# Altium project Pulser.PrjPcb
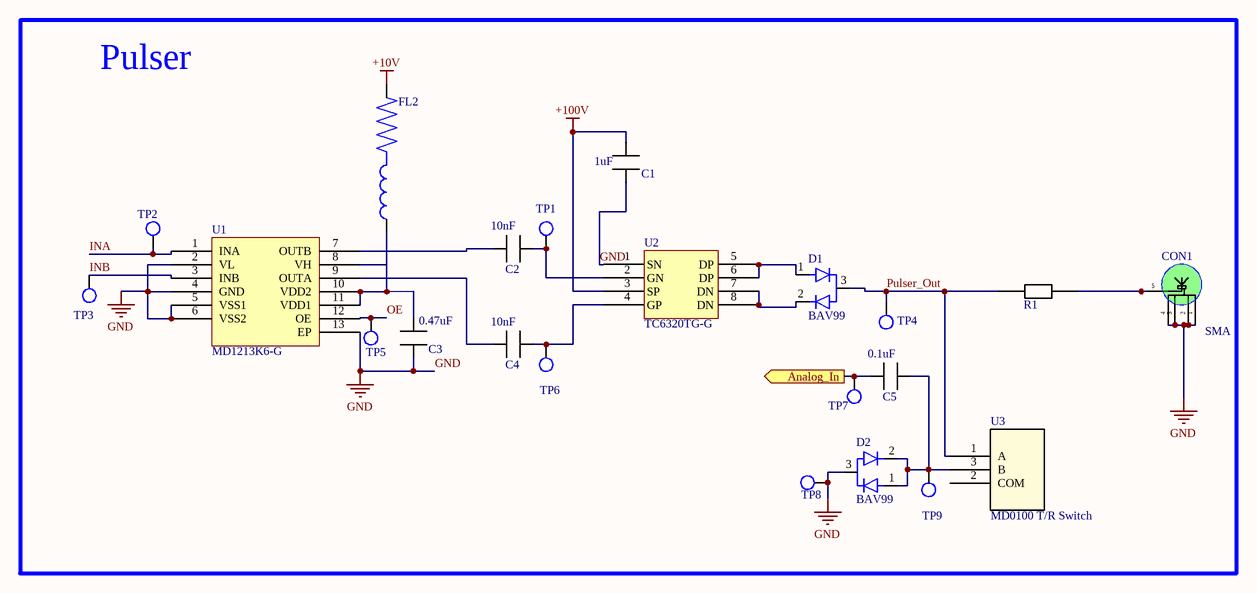
[diagram p0: Pulser.SchDoc]
5 sheets, 85 parts. Net scope: global (net labels, ports and power ports of the same name join across sheets).
Board file: Pulser.PcbDoc
Sheets:
  Pulser.SchDoc
  Analog Front End.SchDoc
  ADC.SchDoc
  Power.SchDoc
  Boost Converter.SchDoc

## Sheet Pulser.SchDoc
size A4; SheetNumber: 1; SheetTotal: 5

### Parts
C1  1uF  [CAP_1206]
C2  10nF  [CAP_0805]
C3  0.47uF  [CAP_0805]
C4  10nF  [CAP_0805]
C5  0.1uF  [CAP_0805]
CON1  SMA  [A-SMA-KWE-15.1A]
D1  BAV99  [DIO_BAV99]
D2  BAV99  [DIO_BAV99]
FL2  (no value)  [BEAD1206S601A40T]
R1  200R  [RES_0805]  (value not drawn)
TP1  TP  [CON_TP]  (value not drawn)
TP2  TP  [CON_TP]  (value not drawn)
TP3  TP  [CON_TP]  (value not drawn)
TP4  TP  [CON_TP]  (value not drawn)
TP5  TP  [CON_TP]  (value not drawn)
TP6  TP  [CON_TP]  (value not drawn)
TP7  TP  [CON_TP]  (value not drawn)
TP8  TP  [CON_TP]  (value not drawn)
TP9  TP  [CON_TP]  (value not drawn)
U1  MD1213K6-G  [QFN80P400X400X90-13N]
U2  TC6320TG-G  [SOIC127P600X175-8N]
U3  MD0100 T/R Switch  [TO-243AA_MCH]

### Blocks framed on the sheet
Pulser: C1-C5 CON1 D1 D2 FL2 R1 TP1-TP9 U1-U3

### Ports
Analog_In (out)

### Nets
+10V: FL2.2
+100V: C1.2 U2.3(SP)
GND: C1.1 C3.2 CON1.1 CON1.2 CON1.3 CON1.4 D2.3 TP8.1(A1) U1.2(VL) U1.4(GND) U1.5(VSS1) U1.6(VSS2) U1.13(EP) U2.1(SN)
Analog_In: C5.1 TP7.1(A1) ; port Analog_In
INA: TP2.1(A1) U1.1(INA)
INB: TP3.1(A1) U1.3(INB)
OE: TP5.1(A1) U1.12(OE)
Pulser_Out: D1.3 R1.1 TP4.1(A1) U3.1(A)
NetC2_1: C2.1 U1.7(OUTB)
NetC2_2: C2.2 TP1.1(A1) U2.2(GN)
NetC3_1: C3.1 FL2.1 U1.8(VH) U1.10(VDD2) U1.11(VDD1)
NetC4_1: C4.1 U1.9(OUTA)
NetC4_2: C4.2 TP6.1(A1) U2.4(GP)
NetC5_2: C5.2 D2.1 D2.2 TP9.1(A1) U3.3(B)
NetCON1_5: CON1.5 R1.2
NetD1_1: D1.1 U2.5(DP) U2.6(DP)
NetD1_2: D1.2 U2.7(DN) U2.8(DN)

Not connected (* = marked no-connect by the designer): U3 2(COM)

### Library data of the parts
C1 = CAP_1206: note: any manufacturer; val: 1uF
C2-C5 = CAP_0805: note: any manufacturer
  C2 C4: val: 10nF
  C3: val: 0.47uF
  C5: val: 0.1uF
CON1 = A-SMA-KWE-15.1A: SMA Connector - 1 Inner Bore SMA Board Side Elbow 6GHz 50Ω 5.35mm Through Hole Coaxial Connector (RF) Adapters RoHS; val: MyAntenna A-SMA-KWE-15.1A; sample link: https://www.lcsc.com/product-detail/C49253491.html?s_z=n_SMA
D1 D2 = BAV99: Diode Array 1 Pair Series Connection Standard 100V 215mA (DC) Surface Mount TO-236-3, SC-59, SOT-23-3; MF: ON Semiconductor; Price: None; Availability: In Stock; MP: BAV99; Package: SOT-23-3 Motorola; SnapEDA_Link: https://www.snapeda.com/parts/BAV99/Onsemi/view-part/?ref=snap; Check_prices: https://www.snapeda.com/parts/BAV99/Onsemi/view-part/?ref=eda; Value: *; Purchase-URL: https://pricing.snapeda.com/search/part/BAV99/?ref=eda
FL2 = BEAD1206S601A40T: MF: Murata; MP: BLM03EB500SZ1D; SnapEDA_Link: https://www.snapeda.com/parts/BLM03EB500SZ1D/Murata/view-part/?ref=snap; Package: 0603 Murata; Value: *; Check_prices: https://www.snapeda.com/parts/BLM03EB500SZ1D/Murata/view-part/?ref=eda
R1 = RES_0805: note: any manufacturer; val: 200R
TP1-TP9 = Test_Point
U3 = MD0100N8-G: Description; Manufacturer_Name: Microchip; Copyright: Copyright (C) 2025 Ultra Librarian. All rights reserved.; Manufacturer_Part_Number: MD0100N8-G; RefDes: RefDes; Type: Type

## Sheet Analog Front End.SchDoc
size A; SheetNumber: 2; SheetTotal: 5
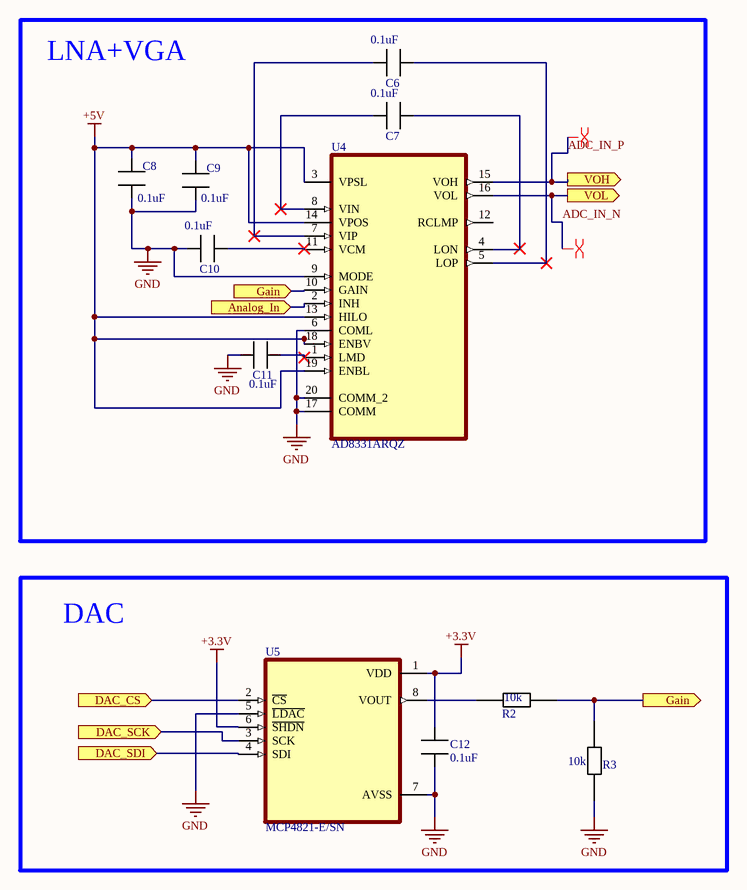
[diagram p1: Analog Front End.SchDoc]

### Parts
C6  0.1uF  [CAP_0805]
C7  0.1uF  [CAP_0805]
C8  0.1uF  [CAP_0805]
C9  0.1uF  [CAP_0805]
C10  0.1uF  [CAP_0805]
C11  0.1uF  [CAP_0805]
C12  0.1uF  [CAP_0805]
R2  10k  [RES_0805]
R3  10k  [RES_0805]
U4  AD8331ARQZ  [SOP64P600X165-20N]
U5  MCP4821-E/SN  [SOIC127P600X175-8N]

### Blocks framed on the sheet
LNA+VGA: C6-C11 U4
DAC: C12 R2 R3 U5

### Ports
Analog_In (in), DAC_CS (in), DAC_SCK (in), DAC_SDI (in), Gain (in), Gain (out), VOH (out), VOL (out)

### Nets
+3.3V: C12.2 U5.1(VDD) U5.6(~{SHDN})
+5V: C8.2 C9.2 U4.3(VPSL) U4.13(HILO) U4.14(VPOS) U4.18(ENBV) U4.19(ENBL)
GND: C8.1 C9.1 C10.1 C11.1 C12.1 R3.1 U4.6(COML) U4.9(MODE) U4.17(COMM) U4.20(COMM_2) U5.5(~{LDAC}) U5.7(AVSS)
ADC_IN_N: U4.16(VOL) ; port VOL
ADC_IN_P: U4.15(VOH) ; port VOH
Analog_In: U4.2(INH) ; port Analog_In
DAC_CS: U5.2(~{CS}) ; port DAC_CS
DAC_SCK: U5.3(SCK) ; port DAC_SCK
DAC_SDI: U5.4(SDI) ; port DAC_SDI
Gain: R2.2 R3.2 U4.10(GAIN) ; port Gain
NetC6_1: C6.1 U4.7(VIP)
NetC6_2: C6.2 U4.5(LOP)
NetC7_1: C7.1 U4.8(VIN)
NetC7_2: C7.2 U4.4(LON)
NetC10_2: C10.2 U4.11(VCM)
NetC11_2: C11.2 U4.1(LMD)
NetR2_1: R2.1 U5.8(VOUT)

Not connected (* = marked no-connect by the designer): U4 12(RCLMP)

### Layout directives
differential pair: ADC_IN_N, ADC_IN_P

### Library data of the parts
C6-C12 = CAP_0805: note: any manufacturer; val: 0.1uF
R2 R3 = RES_0805: note: any manufacturer; val: 10k
U4 = AD8331ARQZ: Single VGA with Ultralow Noise Preamplifier and Programmable RIN; MF: Analog Devices; SnapEDA_Link: https://www.snapeda.com/parts/AD8331ARQZ/Analog+Devices/view-part/?ref=snap; Package: QSOP-20 Analog Devices; Value: *; MP: AD8331ARQZ; Check_prices: https://www.snapeda.com/parts/AD8331ARQZ/Analog+Devices/view-part/?ref=eda
U5 = MCP4821-E/SN: SINGLE 12-BIT DAC WITH SPI INTERACE AND INTERNAL VREF, SOIC-8 | Microchip Technology Inc. MCP4821-E/SN; SnapEDA_Link: https://www.snapeda.com/parts/MCP4821-E/SN/Microchip+Technology/view-part/?ref=snap; Package: SOIC-8 Microchip; Value: *; MF: Microchip; MP: MCP4821-E/SN; Check_prices: https://www.snapeda.com/parts/MCP4821-E/SN/Microchip+Technology/view-part/?ref=eda

## Sheet ADC.SchDoc
size A; SheetNumber: 3; SheetTotal: 5
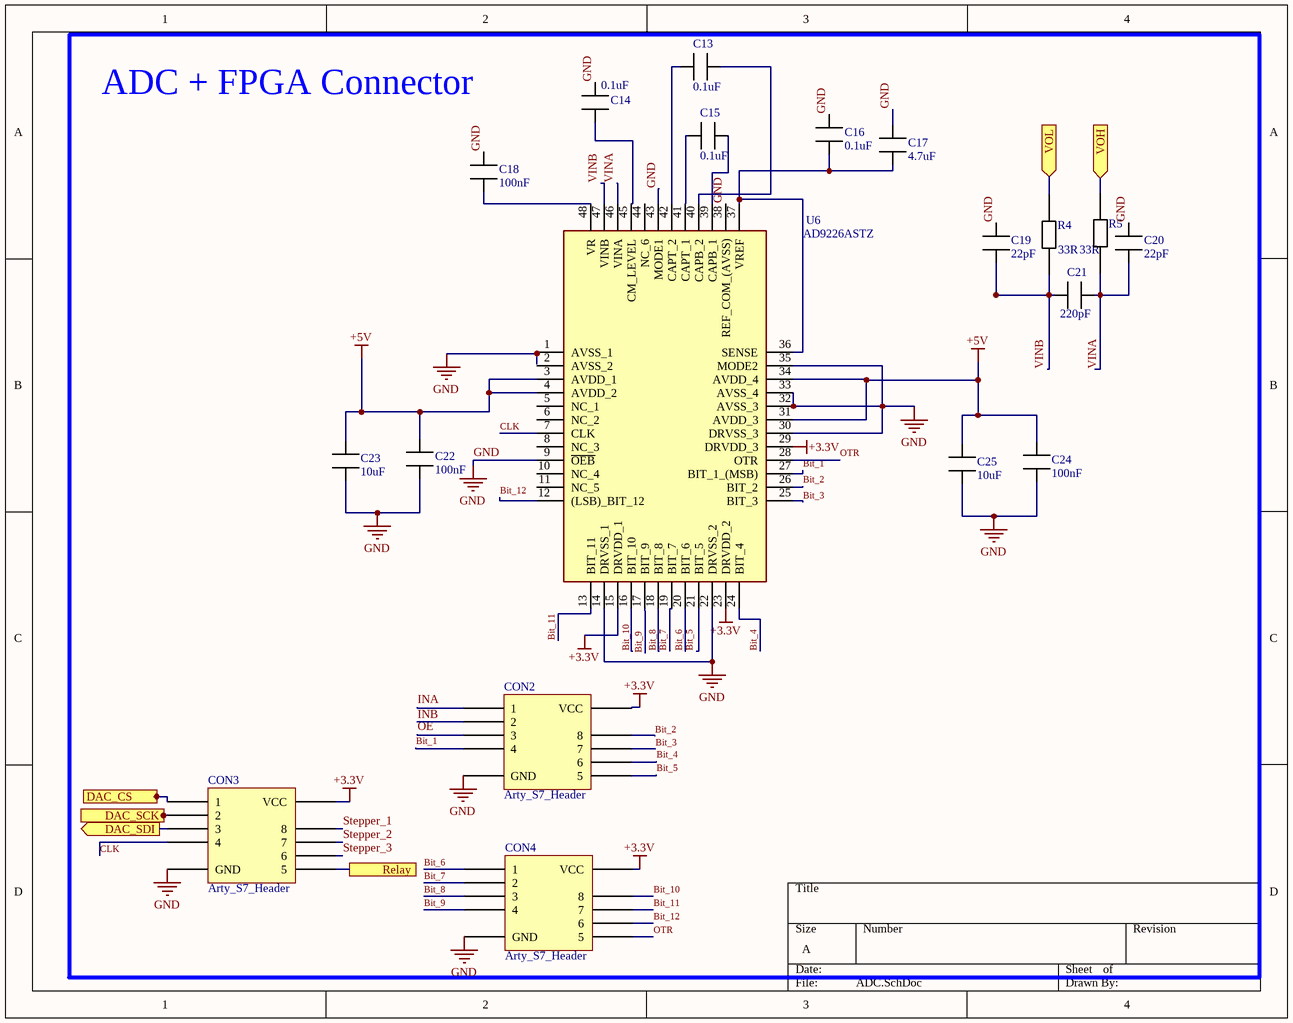
[diagram p2: ADC.SchDoc]

### Parts
C13  0.1uF  [CAP_0805]
C14  0.1uF  [CAP_0805]
C15  0.1uF  [CAP_0805]
C16  0.1uF  [CAP_0805]
C17  4.7uF  [CAP_0805]
C18  100nF  [CAP_0805]
C19  22pF  [CAP_0805]
C20  22pF  [CAP_0805]
C21  220pF  [CAP_0805]
C22  100nF  [CAP_0805]
C23  10uF  [CAP_0805]
C24  100nF  [CAP_0805]
C25  10uF  [CAP_0805]
CON2  Arty_S7_Header  [CON_2x6_2.54MM_THT]
CON3  Arty_S7_Header  [CON_2x6_2.54MM_THT]
CON4  Arty_S7_Header  [CON_2x6_2.54MM_THT]
R4  33R  [RES_0805]
R5  33R  [RES_0805]
U6  AD9226ASTZ  [QFP50P900X900X160-48N]

### Ports
DAC_CS (out), DAC_SCK (out), DAC_SDI (out), Relay, VOH (in), VOL (in)

### Nets
+3.3V: CON2.6(VCC) CON3.6(VCC) CON4.6(VCC) U6.15(DRVDD_1) U6.23(DRVDD_2) U6.29(DRVDD_3)
+5V: C22.1 C23.2 C24.1 C25.2 U6.3(AVDD_1) U6.4(AVDD_2) U6.31(AVDD_3) U6.34(AVDD_4)
GND: C14.1 C16.1 C17.1 C18.1 C19.1 C20.1 C22.2 C23.1 C24.2 C25.1 CON2.5(GND) CON3.5(GND) CON4.5(GND) U6.1(AVSS_1) U6.9(~{OEB}) U6.14(DRVSS_1) U6.22(DRVSS_2) U6.30(DRVSS_3) U6.32(AVSS_3) U6.33(AVSS_4) U6.35(MODE2) U6.38(REF_COM_(AVSS)) U6.43(MODE1)
ADC_IN_N: R4.2 ; port VOL
ADC_IN_P: R5.2 ; port VOH
Bit_1: CON2.4 U6.27(BIT_1_(MSB))
Bit_2: CON2.10(8) U6.26(BIT_2)
Bit_3: CON2.9(7) U6.25(BIT_3)
Bit_4: CON2.8(6) U6.24(BIT_4)
Bit_5: CON2.7(5) U6.21(BIT_5)
Bit_6: CON4.1 U6.20(BIT_6)
Bit_7: CON4.2 U6.19(BIT_7)
Bit_8: CON4.3 U6.18(BIT_8)
Bit_9: CON4.4 U6.17(BIT_9)
Bit_10: CON4.10(8) U6.16(BIT_10)
Bit_11: CON4.9(7) U6.13(BIT_11)
Bit_12: CON4.8(6) U6.12((LSB)_BIT_12)
CLK: CON3.4 U6.7(CLK)
DAC_CS: CON3.1 ; port DAC_CS
DAC_SCK: CON3.2 ; port DAC_SCK
DAC_SDI: CON3.3 ; port DAC_SDI
INA: CON2.1
INB: CON2.2
OE: CON2.3
OTR: CON4.7(5) U6.28(OTR)
Relay: CON3.7(5) ; port Relay
Stepper_1: CON3.10(8)
Stepper_2: CON3.9(7)
Stepper_3: CON3.8(6)
VINA: C20.2 C21.2 R5.1 U6.46(VINA)
VINB: C19.2 C21.1 R4.1 U6.47(VINB)
NetC13_1: C13.1 U6.42(CAPT_2)
NetC13_2: C13.2 U6.40(CAPB_2)
NetC14_2: C14.2 U6.45(CM_LEVEL)
NetC15_1: C15.1 U6.41(CAPT_1)
NetC15_2: C15.2 U6.39(CAPB_1)
NetC16_2: C16.2 C17.2 U6.36(SENSE) U6.37(VREF)
NetC18_2: C18.2 U6.48(VR)

Not connected (* = marked no-connect by the designer): U6 2(AVSS_2) 5(NC_1) 6(NC_2) 8(NC_3) 10(NC_4) 11(NC_5) 44(NC_6)

### Notes on the sheet
- ADC + FPGA Connector

### Library data of the parts
C13-C25 = CAP_0805: note: any manufacturer
  C13-C16: val: 0.1uF
  C17: val: 4.7uF
  C18 C22 C24: val: 100nF
  C19 C20: val: 22pF
  C21: val: 220pF
  C23 C25: val: 10uF
CON2-CON4 = Arty_S7_Header: pin to pad: 5>5+11 6>6+12
R4 R5 = RES_0805: note: any manufacturer; val: 33R
U6 = AD9226ASTZ: AD9226ASTZ, 12 bit-Bit DAC 65Msps, Parallel, 48-Pin LQFP; Manufacturer_Name: Analog Devices; Geometry.Height: 1.6mm; Manufacturer_Part_Number: AD9226ASTZ; Mouser Part Number: 584-AD9226ASTZ; Mouser Price/Stock: https://www.mouser.co.uk/ProductDetail/Analog-Devices/AD9226ASTZ?qs=%2FtpEQrCGXCz2C6o%252BfI8LqA%3D%3D; Arrow Part Number: AD9226ASTZ; Arrow Price/Stock: https://www.arrow.com/en/products/ad9226astz/analog-devices?utm_currency=USD&region=nac; Datasheet Link: https://datasheet.datasheetarchive.com/originals/distributors/Datasheets-4/DSA-70171.pdf

## Sheet Power.SchDoc
size A; SheetNumber: 4; SheetTotal: 5
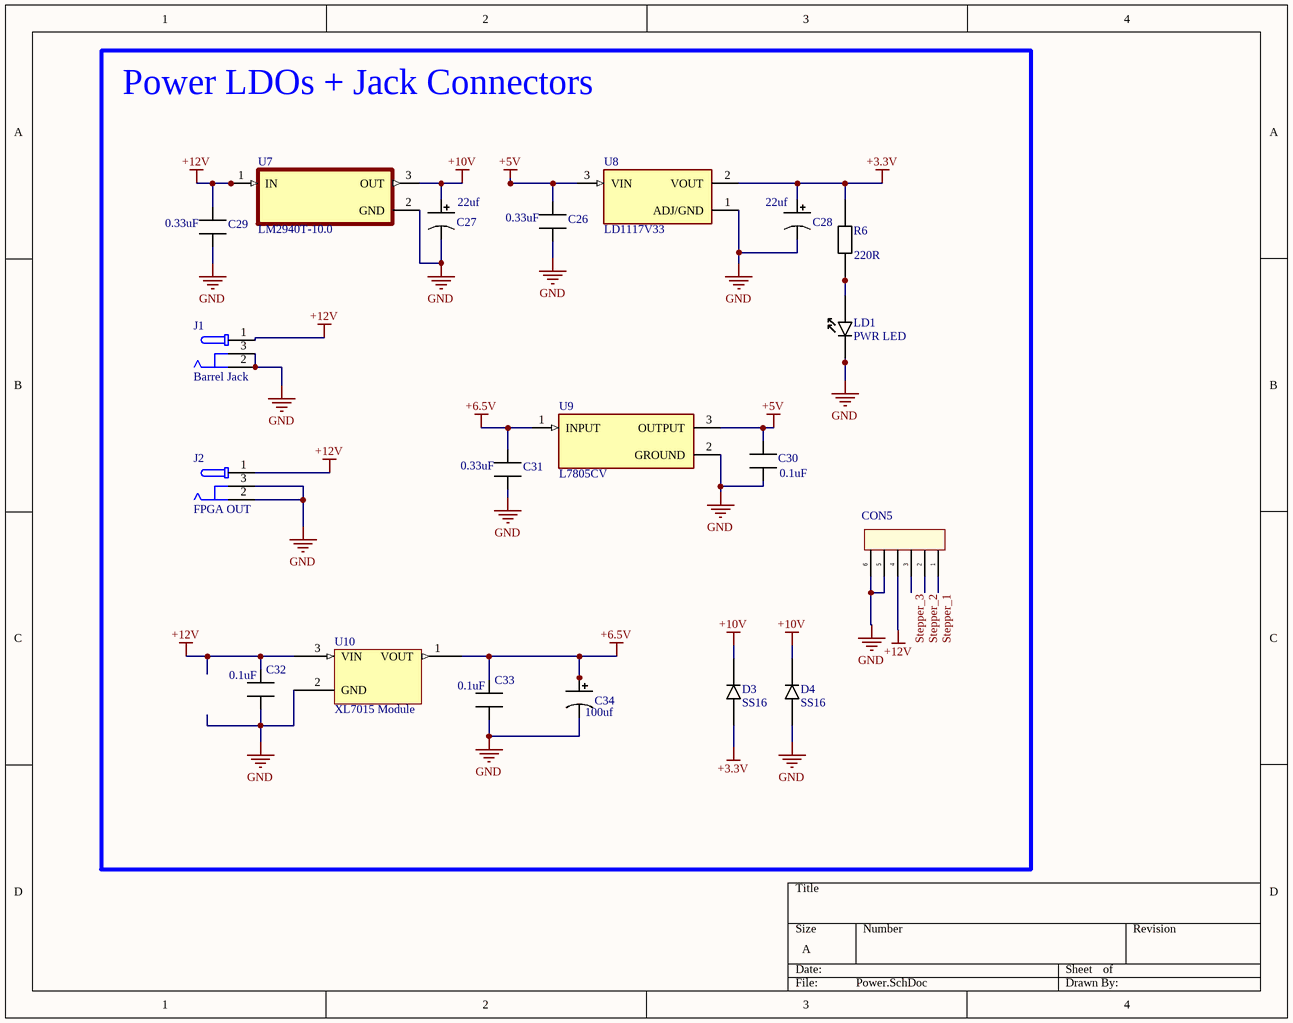
[diagram p3: Power.SchDoc]

### Parts
C26  0.33uF  [CAP_0805]
C27  22uf  [CAP_CAN_D5MM]
C28  22uf  [CAP_CAN_D5MM]
C29  0.33uF  [CAP_0805]
C30  0.1uF  [CAP_0805]
C31  0.33uF  [CAP_0805]
C32  0.1uF  [CAP_0805]
C33  0.1uF  [CAP_0805]
C34  100uf  [CAP_CAN_D5MM]
CON5  KF2EDGV-bend-3.81-6p  [CONGREEN_1x6_3.81]  (value not drawn)
D3  SS16  [DO-214AC]
D4  SS16  [DO-214AC]
J1  Barrel Jack  [MPD_EJ503A]
J2  FPGA OUT  [MPD_EJ503A]
LD1  PWR LED  [LED_0805]
R6  220R  [RES_0805]
U7  LM2940T-10.0  [TO254P1054X470X1955-3]
U8  LD1117V33  [TO255P1020X450X1968-3]
U9  L7805CV  [TO255P1040X460X1968-3]
U10  XL7015 Module  [XL7015]

### Blocks framed on the sheet
Power LDOs + Jack Connectors: C26-C34 CON5 D3 D4 J1 J2 LD1 R6 U7-U10

### Nets
+3.3V: C28.1 D3.2 R6.2 U8.2(VOUT)
+5V: C26.2 C30.2 U8.3(VIN) U9.3(OUTPUT)
+6.5V: C31.2 C33.2 C34.1 U9.1(INPUT) U10.1(VOUT)
+10V: C27.1 D3.1 D4.1 U7.3(OUT)
+12V: C29.2 C32.2 CON5.4 J1.1 J2.1 U7.1(IN) U10.3(VIN)
GND: C26.1 C27.2 C28.2 C29.1 C30.1 C31.1 C32.1 C33.1 C34.2 CON5.5 CON5.6 D4.2 J1.2 J1.3 J2.2 J2.3 LD1.1 U7.2(GND) U8.1(ADJ/GND) U9.2(GROUND) U10.2(GND)
Stepper_1: CON5.1
Stepper_2: CON5.2
Stepper_3: CON5.3
NetLD1_2: LD1.2 R6.1

### Library data of the parts
C26 C29-C33 = CAP_0805: note: any manufacturer
  C26 C29 C31: val: 0.33uF
  C30 C32 C33: val: 0.1uF
C27 C28 C34 = CAP_CAN_D5mm: SMD Can Capacitor; 5mm Diameter; note: any manufacturer; sample link: https://www.lcsc.com/product-detail/C3357.html?s_z=n_10uF%2520SMD%2520Can%2520Capacitor%2520D5%2520RVT
  C27 C28: val: 22uf
  C34: val: 100uf
CON5 = CONGREEN_1x6_3.81: note: any manufacturer; val: KF2EDGV-bend-3.81-6p; sample link: https://detail.tmall.com/item.htm?abbucket=7&id=563239224672&mi_id=0000eNg2RX4a54sA2dO6nQBcXewI5pOIaHq0cbOnq7H1ZG4&ns=1&priceTId=2100c82417719338414588309e0c91&skuId=3549204641034&spm=a21n57.1.hoverItem.2&utparam=%7B%22aplus_abtest%22%3A%22cd8050d06d499e492f7c0b37ee11abfb%22%7D&xxc=taobaoSearch
D3 D4 = SS16: Independent 60V 700mV@1A 1A SMA(DO-214AC) Single Diodes RoHS; note: any manufacturer; val: SS16; sample link: https://www.lcsc.com/product-detail/Schottky-Barrier-Diodes-SBD_GOODWORK-SS16_C2943739.html; unit price: $ 0.0122
J1 J2 = EJ503A: Power Barrel Connector Jack 2.10mm ID (0.083), 5.50mm OD (0.217) Through Hole, Right Angle; MF: MPD; Package: None; Price: None; Check_prices: https://www.snapeda.com/parts/EJ503A/MPD+%2528Memory+Protection+Devices%2529/view-part/?ref=eda; Value: *; SnapEDA_Link: https://www.snapeda.com/parts/EJ503A/MPD+%2528Memory+Protection+Devices%2529/view-part/?ref=snap; MP: EJ503A; Availability: In Stock; Purchase-URL: https://pricing.snapeda.com/search?q=EJ503A&ref=eda
LD1 = LED_0805
R6 = RES_0805: note: any manufacturer; val: 220R
U7 = LM2940T-10.0: 1-A, 26-V, high-PSRR, low-dropout voltage regulator 3-TO-220 -40 to 125; MF: Texas Instruments; MP: LM2940T-5.0; SnapEDA_Link: https://www.snapeda.com/parts/LM2940T-5.0/Texas+Instruments/view-part/?ref=snap; Package: TO-220-3 Texas Instruments; Value: *; Check_prices: https://www.snapeda.com/parts/LM2940T-5.0/Texas+Instruments/view-part/?ref=eda
U8 = LD1117V33: Linear Voltage Regulator IC Positive Fixed 1 Output 800mA TO-220AB; MF: STMicroelectronics; SnapEDA_Link: https://www.snapeda.com/parts/LD1117V33/STMicroelectronics/view-part/?ref=snap; Package: TO-220-3 STMicroelectronics; Value: *; MP: LD1117V33; Check_prices: https://www.snapeda.com/parts/LD1117V33/STMicroelectronics/view-part/?ref=eda
U9 = L7805CV: Linear Voltage Regulator IC Positive Fixed 1 Output 1.5A TO-220; MF: STMicroelectronics; SnapEDA_Link: https://www.snapeda.com/parts/L7805CV/STMicroelectronics/view-part/?ref=snap; Package: TO-220-3 STMicroelectronics; Value: *; MP: L7805CV; Check_prices: https://www.snapeda.com/parts/L7805CV/STMicroelectronics/view-part/?ref=eda
U10 = XL7015: Buck Converter

## Sheet Boost Converter.SchDoc
size A; SheetNumber: 5; SheetTotal: 5
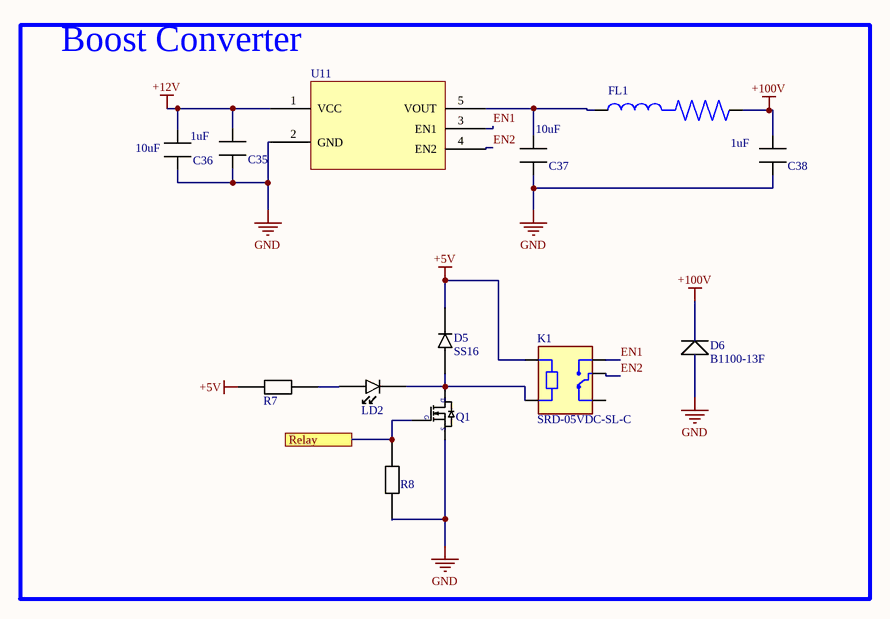
[diagram p4: Boost Converter.SchDoc]

### Parts
C35  1uF  [CAP_1206]
C36  10uF  [CAP_0805]
C37  10uF  [CAP_1206]
C38  1uF  [CAP_1206]
D5  SS16  [DO-214AC]
D6  B1100-13F  [DIOM5226X230N]
FL1  (no value)  [BEAD1206S601A40T]
K1  SRD-05VDC-SL-C  [RELAY_SRD-05VDC-SL-C]
LD2  LED_0805  [LED_0805]  (value not drawn)
Q1  DMN3404L-7  [SOT23-3]  (value not drawn)
R7  330  [RES_0805]  (value not drawn)
R8  4.7k  [RES_0805]  (value not drawn)
U11  Boost_Conv_Module  [Boost_Converter]  (value not drawn)

### Blocks framed on the sheet
Boost Converter: C35-C38 D5 D6 FL1 K1 LD2 Q1 R7 R8 U11

### Ports
Relay

### Nets
+5V: D5.1 K1.A1 R7.2
+12V: C35.2 C36.2 U11.1(VCC)
+100V: C38.2 D6.1(-) FL1.2
GND: C35.1 C36.1 C37.1 C38.1 D6.2(+) Q1.2 R8.1 U11.2(GND)
EN1: K1.NO U11.3(EN1)
EN2: K1.COM U11.4(EN2)
Relay: Q1.1 R8.2 ; port Relay
NetC37_2: C37.2 FL1.1 U11.5(VOUT)
NetD5_2: D5.2 K1.A2 LD2.1 Q1.3
NetLD2_2: LD2.2 R7.1

Not connected (* = marked no-connect by the designer): K1 NC

### Notes on the sheet
- (in symbol DMN3404L-7) D; G; S

### Library data of the parts
C35 C37 C38 = CAP_1206: note: any manufacturer
  C35 C38: val: 1uF
  C37: val: 10uF
C36 = CAP_0805: note: any manufacturer; val: 10uF
D5 = SS16: as D3 on sheet Power; val: SS16; sample link: https://www.lcsc.com/product-detail/Schottky-Barrier-Diodes-SBD_GOODWORK-SS16_C2943739.html; unit price: $ 0.0122
FL1 = BEAD1206S601A40T: MF: Murata; MP: BLM03EB500SZ1D; SnapEDA_Link: https://www.snapeda.com/parts/BLM03EB500SZ1D/Murata/view-part/?ref=snap; Package: 0603 Murata; Value: *; Check_prices: https://www.snapeda.com/parts/BLM03EB500SZ1D/Murata/view-part/?ref=eda
K1 = SRD-05VDC-SL-C: 5V Trigger Relay Module For Arduino And Raspberry Pi 5V Trigger Relay Module For Arduino And Raspberry Pi; MF: Songle Relay; Check_prices: https://www.snapeda.com/parts/SRD-05VDC-SL-C/Songle+Relay/view-part/?ref=eda; Value: *; Availability: Not in stock; Price: None; Package: NON STANDARD-5 Songle Relay; MP: SRD-05VDC-SL-C; SnapEDA_Link: https://www.snapeda.com/parts/SRD-05VDC-SL-C/Songle+Relay/view-part/?ref=snap
Q1 = DMN3404L-7: N-Channel 30V 5.8A 1.4W Surface Mount SOT-23; note: Original; val: DMN3404L-7; sample link: https://www.lcsc.com/product-detail/MOSFETs_Diodes-Incorporated-DMN3404L-7_C155257.html; unit price: $ 0.1522
R7 R8 = RES_0805: note: any manufacturer
  R7: val: 330
  R8: val: 4.7k
U11 = Boost_Converter

## Nets that join several sheets
+3.3V: Analog Front End (C12.2 U5.1 U5.6), ADC (6 pins), Power (C28.1 D3.2 R6.2 U8.2)
+5V: Analog Front End (7 pins), ADC (8 pins), Power (C26.2 C30.2 U8.3 U9.3), Boost Converter (D5.1 K1.A1 R7.2)
+10V: Pulser (FL2.2), Power (C27.1 D3.1 D4.1 U7.3)
+12V: Power (7 pins), Boost Converter (C35.2 C36.2 U11.1)
+100V: Pulser (C1.2 U2.3), Boost Converter (C38.2 D6.1 FL1.2)
GND: Pulser (14 pins), Analog Front End (12 pins), ADC (23 pins), Power (21 pins), Boost Converter (8 pins)
ADC_IN_N: Analog Front End (U4.16), ADC (R4.2)
ADC_IN_P: Analog Front End (U4.15), ADC (R5.2)
Analog_In: Pulser (C5.1 TP7.1), Analog Front End (U4.2)
DAC_CS: Analog Front End (U5.2), ADC (CON3.1)
DAC_SCK: Analog Front End (U5.3), ADC (CON3.2)
DAC_SDI: Analog Front End (U5.4), ADC (CON3.3)
INA: Pulser (TP2.1 U1.1), ADC (CON2.1)
INB: Pulser (TP3.1 U1.3), ADC (CON2.2)
OE: Pulser (TP5.1 U1.12), ADC (CON2.3)
Relay: ADC (CON3.7), Boost Converter (Q1.1 R8.2)
Stepper_1: ADC (CON3.10), Power (CON5.1)
Stepper_2: ADC (CON3.9), Power (CON5.2)
Stepper_3: ADC (CON3.8), Power (CON5.3)